# Altium schematic sheet LT8311-Main.SchDoc
size A
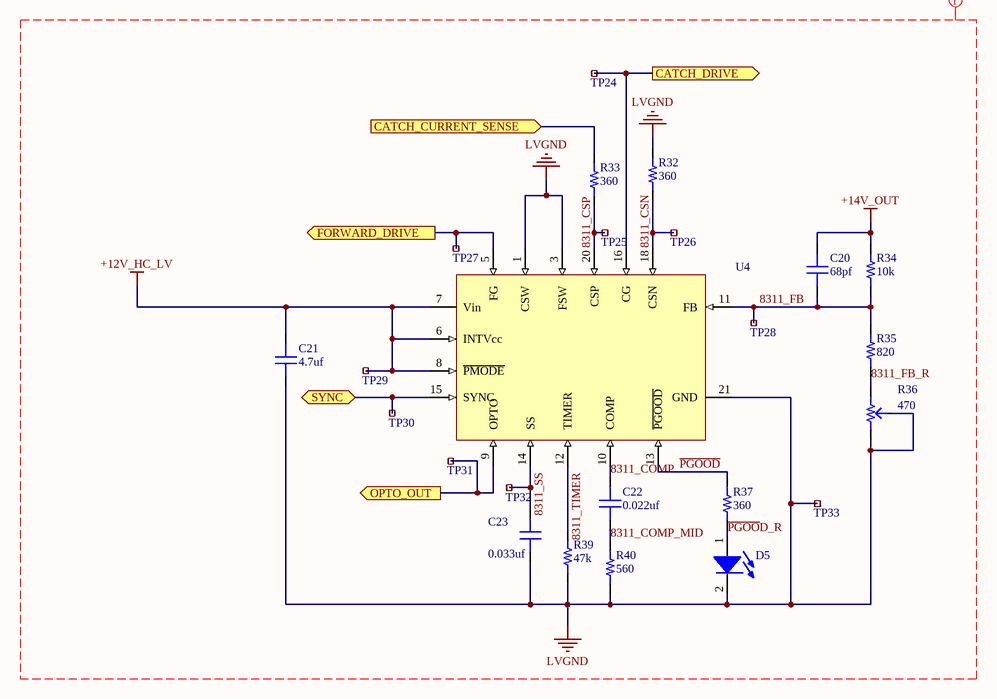
[diagram p0: LT8311-Main.SchDoc]

## Parts
C20  value 68pf  [CAP 0603/1608]  (hidden comment: Capacitor MLCC 68pf 25V CAP 0603/1608)
C21  value 4.7uf  [CAP 0805/2012]  (hidden comment: Capacitor MLCC 4.7uf 25V CAP 0805/2012)
C22  value 0.022uf  [CAP 0603/1608]  (hidden comment: Capacitor MLCC 0.022uf 16V CAP 0603/1608)
C23  value 0.033uf  [CAP 0603/1608]  (hidden comment: Capacitor MLCC 0.033uf 16V CAP 0603/1608)
D5  (no value)  [0805_LED]
R32  value 360  [RES 0603/1608]  (hidden comment: Resistor 360 0603 1/10W 1%)
R33  value 360  [RES 0603/1608]  (hidden comment: Resistor 360 0603 1/10W 1%)
R34  value 10k  [RES 0603/1608]  (hidden comment: Resistor 10k 0603 1/10W 1%)
R35  value 820  [RES 0603/1608]  (hidden comment: Resistor 820 0603 1/10W 1%)
R36  value 470  [PT6WV]  (hidden comment: TRIMMER 470 OHM LINEAR)
R37  value 360  [RES 0603/1608]  (hidden comment: Resistor 360 0603 1/10W 1%)
R39  value 47k  [RES 0603/1608]  (hidden comment: Resistor 47k 0603 1/10W 1%)
R40  value 560  [RES 0603/1608]  (hidden comment: Resistor 560 0603 1/10W 1%)
TP24  RCU-0C  [5029]  (value not drawn)
TP25  RCU-0C  [5029]  (value not drawn)
TP26  RCU-0C  [5029]  (value not drawn)
TP27  RCU-0C  [5029]  (value not drawn)
TP28  RCU-0C  [5029]  (value not drawn)
TP29  RCU-0C  [5029]  (value not drawn)
TP30  RCU-0C  [5029]  (value not drawn)
TP31  RCU-0C  [5029]  (value not drawn)
TP32  RCU-0C  [5029]  (value not drawn)
TP33  RCU-0C  [5029]  (value not drawn)
U4  (no value)  [FE20(16)]

## Ports
CATCH_CURRENT_SENSE (in), CATCH_DRIVE (out), FORWARD_DRIVE (out), OPTO_OUT (out), SYNC (bidir)

## Nets
+12V_HC_LV: C21.2 TP29.1 U4.6(INTVcc) U4.7(Vin) U4.8(~{PMODE})
+14V_OUT: C20.2 R34.2
LVGND: C21.1 C23.2 D5.2(K) R32.2 R36.2 R39.1 R40.1 TP33.1 U4.1(CSW) U4.3(FSW) U4.21(GND)
8311_COMP: C22.2 U4.10(COMP)
8311_COMP_MID: C22.1 R40.2
8311_CSN: R32.1 TP26.1 U4.18(CSN)
8311_CSP: R33.1 TP25.1 U4.20(CSP)
8311_FB: C20.1 R34.1 R35.2 TP28.1 U4.11(FB)
8311_FB_R: R35.1 R36.1
8311_SS: C23.1 TP32.1 U4.14(SS)
8311_TIMER: R39.2 U4.12(TIMER)
CATCH_CURRENT_SENSE: R33.2 ; port CATCH_CURRENT_SENSE
CATCH_DRIVE: TP24.1 U4.16(CG) ; port CATCH_DRIVE
FORWARD_DRIVE: TP27.1 U4.5(FG) ; port FORWARD_DRIVE
OPTO_OUT: TP31.1 U4.9(OPTO) ; port OPTO_OUT
~{PGOOD}: R37.2 U4.13(~{PGOOD})
~{PGOO}D_R: D5.1(A) R37.1
SYNC: TP30.1 U4.15(SYNC) ; port SYNC

Not connected (* = marked no-connect by the designer): R36 3

## Layout directives
net class LV: 8311_COMP, 8311_COMP_MID, 8311_CSN, 8311_CSP, 8311_FB, 8311_FB_R, 8311_SS, 8311_TIMER, +12V_HC_LV, +14V_OUT, LVGND, ~{PGOOD}, ~{PGOO}D_R

## Library data of the parts
C20 = 525: Manufacturer_id: 1; idCapacitor: 525; Name: Cap_68pf_25V_CAP 0603/1608; Dielectric: Ceramic; Created_By: Nick Mah; Drawer_id: 1; Voltage_Rating: 25V; Package: CAP 0603/1608; Created_Date: 10/20/2018
C21 = 713: Manufacturer_id: 1; idCapacitor: 713; Name: Cap_4.7uf_25V_CAP 0805/2012; Dielectric: Ceramic; Created_By: Nick Mah; Drawer_id: 1; Voltage_Rating: 25V; Package: CAP 0805/2012; Created_Date: 10/20/2018
C22 = 219: Manufacturer_id: 1; idCapacitor: 219; Name: Cap_0.022uf_16V_CAP 0603/1608; Dielectric: Ceramic; Created_By: Nick Mah; Drawer_id: 1; Voltage_Rating: 16V; Package: CAP 0603/1608; Created_Date: 10/20/2018
C23 = 220: Manufacturer_id: 1; idCapacitor: 220; Name: Cap_0.033uf_16V_CAP 0603/1608; Dielectric: Ceramic; Created_By: Nick Mah; Drawer_id: 1; Voltage_Rating: 16V; Package: CAP 0603/1608; Created_Date: 10/20/2018
D5 = 1: idLED: 1; Name: LED_0805_RED; Value: Red; Vf: 0.7V; Manufacturer_id: 1; Drawer_id: 1; Package: 0805
R32 R33 R37 = 278: Manufacturer_id: 1; idResistor: 278; Name: Res_360_0603_1/10W_1%; Created_By: Nick Mah; Supplier 1: Digi-Key; Drawer_id: 1; Tolerance: 1%; Power: 1/10W; Package: 0603; ComponentLink1Description: Datasheet; Created_Date: 2018-10-20
R34 = 313: Manufacturer_id: 1; idResistor: 313; Name: Res_10k_0603_1/10W_1%; Created_By: Nick Mah; Supplier 1: Digi-Key; Drawer_id: 1; Tolerance: 1%; Power: 1/10W; Package: 0603; ComponentLink1Description: Datasheet; Created_Date: 2018-10-20
R35 = 287: Manufacturer_id: 1; idResistor: 287; Name: Res_820_0603_1/10W_1%; Created_By: Nick Mah; Supplier 1: Digi-Key; Drawer_id: 1; Tolerance: 1%; Power: 1/10W; Package: 0603; ComponentLink1Description: Datasheet; Created_Date: 2018-10-20
R36 = 2715: 470 Ohm 1 Gang Linear Through Hole Potentiometer None 1 Turn Carbon 0.1W, 1/10W PC Pins; Manufacturer_id: 1; idResistor: 2715; Name: PT6WV-471A2020; Tolerance: 20%; Created_By: Nick Mah; Supplier 1: Digi-Key; Supplier Part Number 1: 1993-1025-ND; Drawer_id: 1; Power: 1/10W; Package: TH; MfrPartNo: PT6WV-471A2020; Link: https://www.digikey.com/product-detail/en/amphenol-piher-sensing-systems/PT6WV-471A2020/1993-1025-ND/9555863; ComponentLink1Description: Datasheet; ComponentLink1URL: https://www.mouser.com/datasheet/2/18/11-PT6v03-1499160.pdf
R39 = 329: Manufacturer_id: 1; idResistor: 329; Name: Res_47k_0603_1/10W_1%; Created_By: Nick Mah; Supplier 1: Digi-Key; Drawer_id: 1; Tolerance: 1%; Power: 1/10W; Package: 0603; ComponentLink1Description: Datasheet; Created_Date: 2018-10-20
R40 = 283: Manufacturer_id: 1; idResistor: 283; Name: Res_560_0603_1/10W_1%; Created_By: Nick Mah; Supplier 1: Digi-Key; Drawer_id: 1; Tolerance: 1%; Power: 1/10W; Package: 0603; ComponentLink1Description: Datasheet; Created_Date: 2018-10-20
TP24-TP33 = 28: Test point; Manufacturer_id: 1; idConn: 28; Value: CONN; Created_By: Jason Zhou; Drawer_id: 1; Name: 5029; Num_Contacts: 1; Num_Rows: 1; Package: 5029; MfrPartNo: 5029; Link: https://www.digikey.com/product-detail/en/keystone-electronics/5029/36-5029CT-ND/5980631; ComponentLink1Description: Datasheet; ComponentLink1URL: file:///C:/Users/Jason%20Zhou/Downloads/5029.PDF; Supplier1: Digi-Key; Supplier1PartNo: 36-5029CT-ND; Created_Date: 4/26/2019
U4 = 4: Power Supply Controller Secondary-Side Controller; Manufacturer_id: 1; MfrPartNo: LT8311FE; idPMIC_SW: 4; Name: LT8311 MOSFET Driver; Value: Secondary Side Controller; Discrete: No; Topology: Synchronous Rectifier; Vout_Type: Adjustable; Created_By: Jason; Drawer_id: 1; Num_Outputs: 1; Package: 20-TSSOP; Link: https://www.digikey.com/product-detail/en/linear-technology-analog-devices/LT8311HFE-PBF/LT8311HFE-PBF-ND/4808890; ComponentLink1Description: Datasheet; ComponentLink1URL: https://www.analog.com/media/en/technical-documentation/data-sheets/8311f.pdf; Supplier1: Digi-Key; Supplier1PartNo: LT8311HFE#PBF-ND